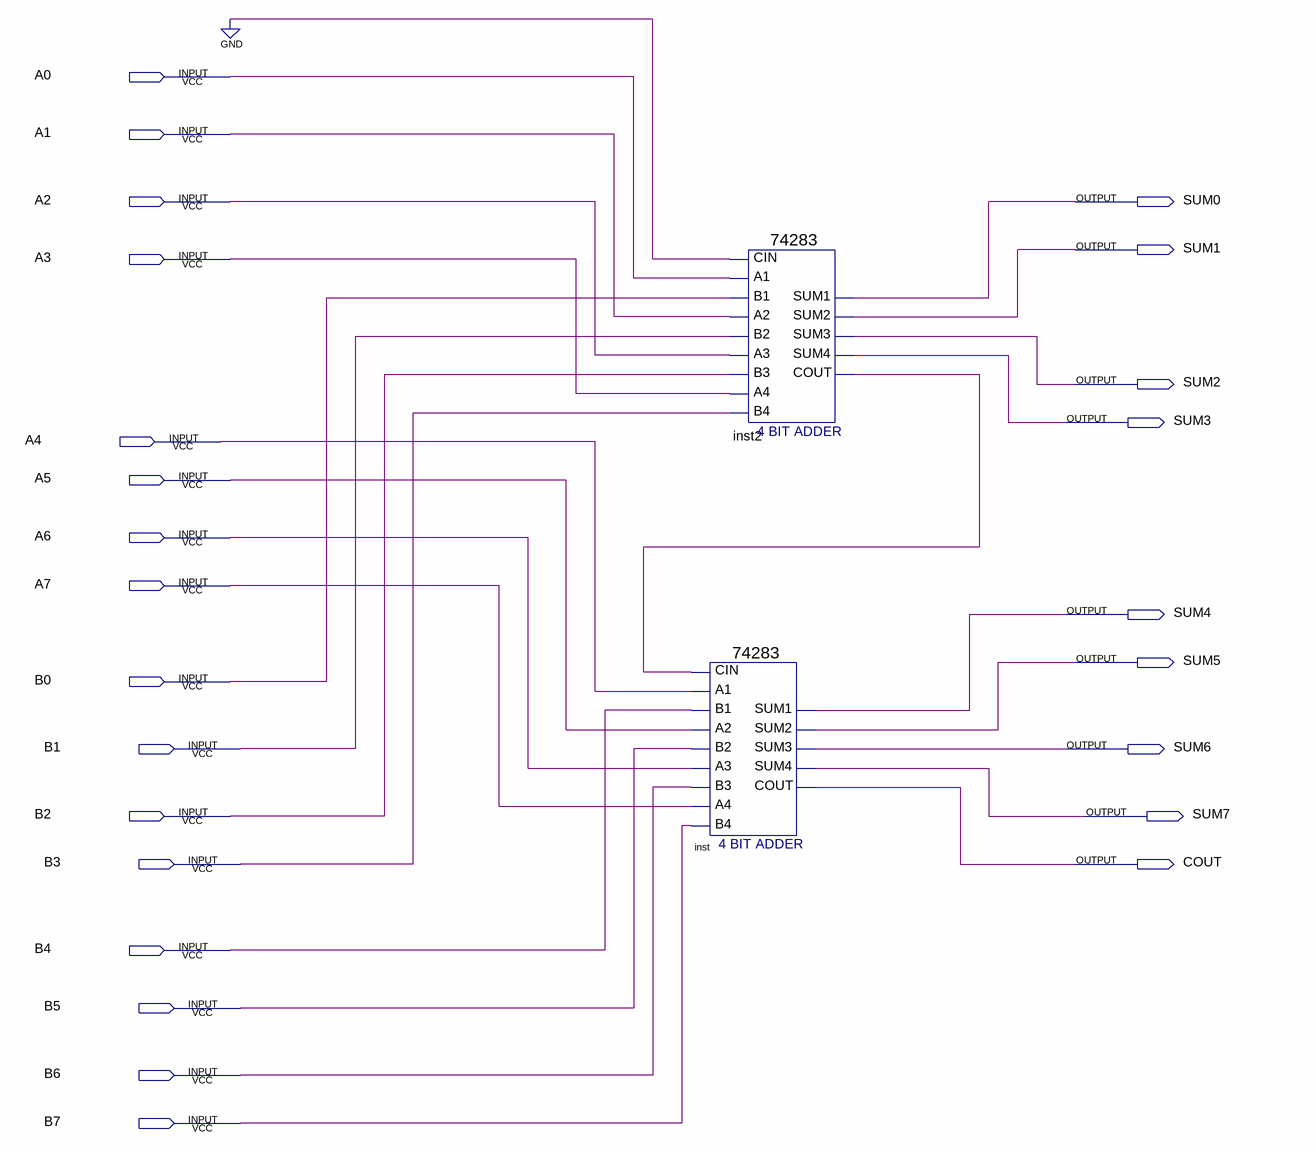
[diagram p0: schematic sheet]
// Quartus schematic Eight_bit_adder.bdf as structural Verilog: 2 symbols, 25 pins
module Eight_bit_adder (
  input  A0,
  input  A1,
  input  A2,
  input  A3,
  input  A4,
  input  A5,
  input  A6,
  input  A7,
  input  B0,
  input  B1,
  input  B2,
  input  B3,
  input  B4,
  input  B5,
  input  B6,
  input  B7,
  output SUM0,
  output SUM1,
  output SUM2,
  output SUM3,
  output SUM4,
  output SUM5,
  output SUM6,
  output SUM7,
  output COUT
);

  wire inst2_cout;

  \74283  inst2 (
    .CIN(1'b0), .A1(A0), .A2(A1), .B2(B1), .A3(A2), .A4(A3), .B4(B3), .B1(B0), .B3(B2), .SUM4(SUM3),
    .COUT(inst2_cout), .SUM1(SUM0), .SUM2(SUM1), .SUM3(SUM2));
  \74283  inst (
    .CIN(inst2_cout), .A1(A4), .A2(A5), .B2(B5), .A3(A6), .A4(A7), .B4(B7), .B1(B4), .B3(B6), .SUM4(SUM7),
    .COUT(COUT), .SUM1(SUM4), .SUM2(SUM5), .SUM3(SUM6));
endmodule
